# EAGLE design sensor_v3b (EAGLE 6.5.0)
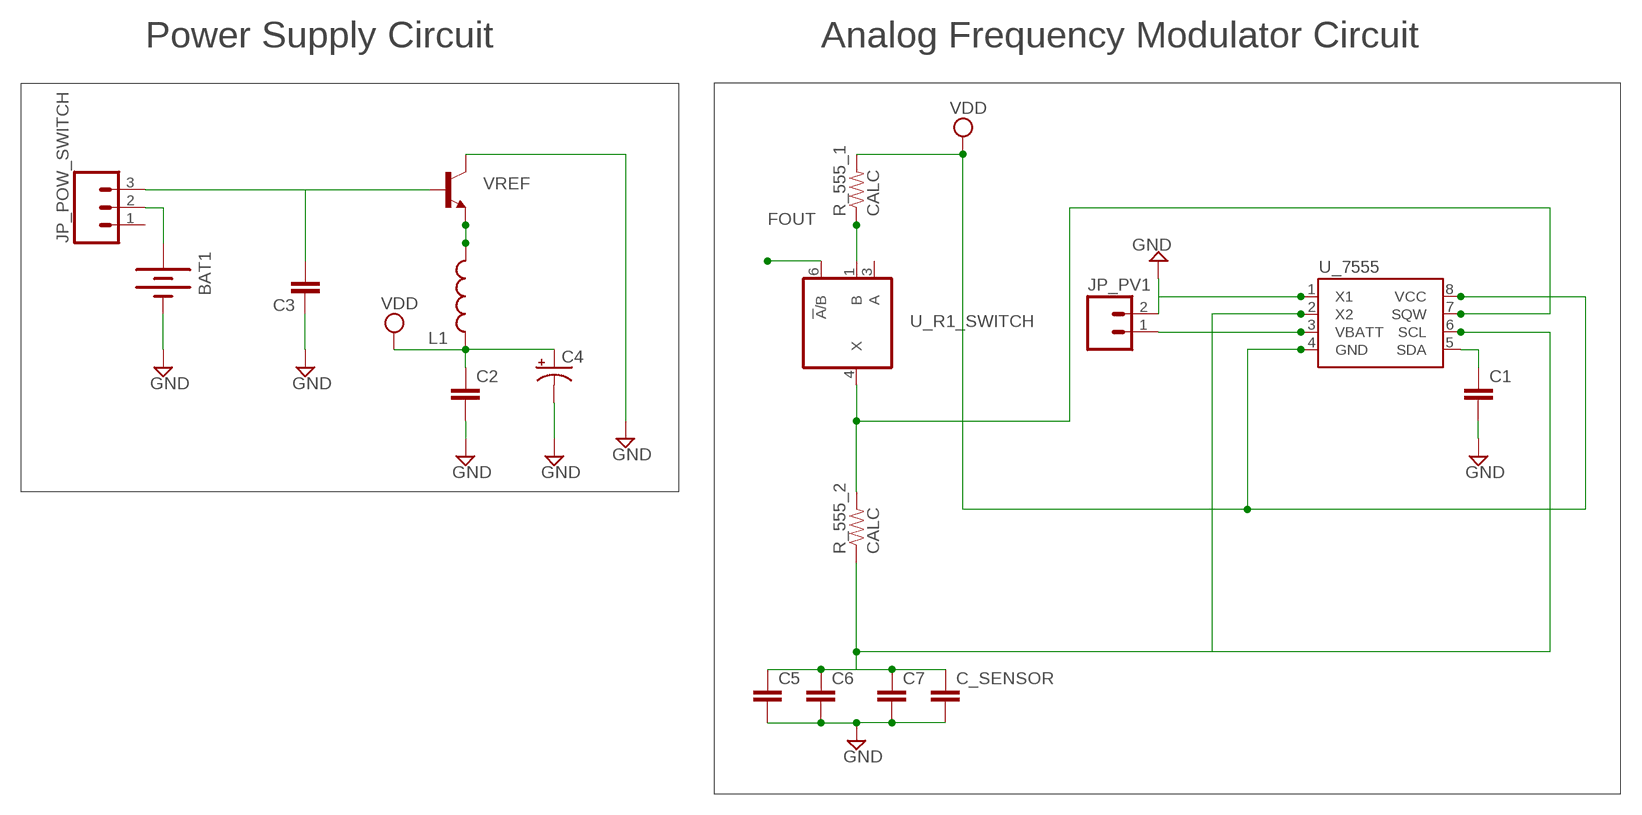
[diagram p0: schematic, sheet 1]

## Parts
BAT1  BATTERY20PTH_LAB  [BATTCOM_20MM_PTH]
C1  CAP0603-CAP  [0603-CAP]
C2  CAP0603-CAP  [0603-CAP]
C3  CAP0603-CAP  [0603-CAP]
C4  CAP_POL1206  [EIA3216]
C5  CAP0805  [0805]
C6  CAP0805  [0805]
C7  CAP0805  [0805]
C_SENSOR  CAP0805  [0805]
JP_POW_SWITCH  M03LOCK  [1X03_LOCK]
JP_PV1  M02LOCK  [1X02_LOCK]
L1  INDUCTOR0603  [0603]
R_555_1  CALC  RESISTOR0805-RES  [0805]
R_555_2  CALC  RESISTOR0805-RES  [0805]
U_7555  DS1307SO8  [SO08]
U_R1_SWITCH  741G3157DCKR  [DCK_R-PDSO-G6]
U_VREF  TRANSISTOR_NPNSOT23-3  [SOT23-3]

## Nets
FOUT: JP_PV1.1 U_7555.3(VBATT) U_R1_SWITCH.6(!A!/B)
GND: BAT1.2(-) C1.2 C2.2 C3.1 C4.C(-) C5.2 C6.2 C7.2 C_SENSOR.2 JP_PV1.2 U_7555.1(X1) U_VREF.3(C)
N$6: BAT1.1(+) JP_POW_SWITCH.2
P2: C5.1 C6.1 C7.1 C_SENSOR.1 R_555_2.1 U_7555.2(X2) U_7555.6(SCL)
P5: C1.1 U_7555.5(SDA)
P7: R_555_2.2 U_7555.7(SQW) U_R1_SWITCH.4(X)
R1: R_555_1.1 U_R1_SWITCH.1(B)
VDD: C2.1 C4.A(+) L1.1 R_555_1.2 U_7555.4(GND) U_7555.8(VCC)
VREFIN: C3.2 JP_POW_SWITCH.3 U_VREF.1(B)
VREFOUT: L1.2 U_VREF.2(E)
Unconnected: JP_POW_SWITCH.1 U_R1_SWITCH.3(A)

## Notes on the sheet
- Power Supply Circuit | Analog Frequency Modulator Circuit
- VREF

## Power pins joined to a net without a drawn wire
GND: U_R1_SWITCH.2(GND)
VCC: U_R1_SWITCH.5(VCC)

## Library data of the parts
BAT1 = semipassiveTag_library:BATTERY: Battery Holders Various common sizes : AA, AAA, 20mm coin cell and 12mm coin cell.
C1-C3 = SparkFun-Capacitors:CAP: Capacitor Standard 0603 ceramic capacitor, and 0.1" leaded capacitor.
C4 = SparkFun-Capacitors:CAP_POL: Capacitor Polarized These are standard SMD and PTH capacitors. Normally 10uF, 47uF, and 100uF in electrolytic and tantalum varieties. Always verify the external diameter of the through hole cap, it varies with capacity, voltage, and manufacturer. The EIA devices should be standard.
C5-C7 C_SENSOR = SparkFun:CAP: Capacitor Standard 0603 ceramic capacitor, and 0.1" leaded capacitor.
JP_POW_SWITCH = SparkFun-Connectors:M03: Header 3 Standard 3-pin 0.1" header. Use with straight break away headers (SKU : PRT-00116), right angle break away headers (PRT-00553), swiss pins (PRT-00743), machine pins (PRT-00117), and female headers (PRT-00115). Molex polarized connector foot print use with SKU : PRT-08232 with associated crimp pins and housings.
JP_PV1 = SparkFun-Connectors:M02: Header 2 Standard 2-pin 0.1" header. Use with straight break away headers (SKU : PRT-00116), right angle break away headers (PRT-00553), swiss pins (PRT-00743), machine pins (PRT-00117), and female headers (PRT-00115). Molex polarized connector foot print use with SKU : PRT-08233 with associated crimp pins and housings.
L1 = SparkFun-Passives:INDUCTOR: Inductors Basic Inductor/Choke - 0603 and 1206. Footprints are not proven and vary greatly between part numbers.
R_555_1 R_555_2 = SparkFun-Resistors:RESISTOR: Resistor Basic schematic elements and footprints for 0603, 1206, and PTH resistors.
U_7555 = SparkFun-FreqCtrl:DS1307: I2C real-time clock with battery backup.
U_R1_SWITCH = 74xx-little-de:74*1G3157: Single-Pole, Double-Throw Analog Switch Source: http://focus.ti.com/lit/ds/symlink/sn74lvc1g3157.pdf
U_VREF = SparkFun:TRANSISTOR_NPN: Transistor NPN BJT configuration in SOT23 package. MMBT2222 is the common NPN we use. Double check BCE configuration again layout.

## Board
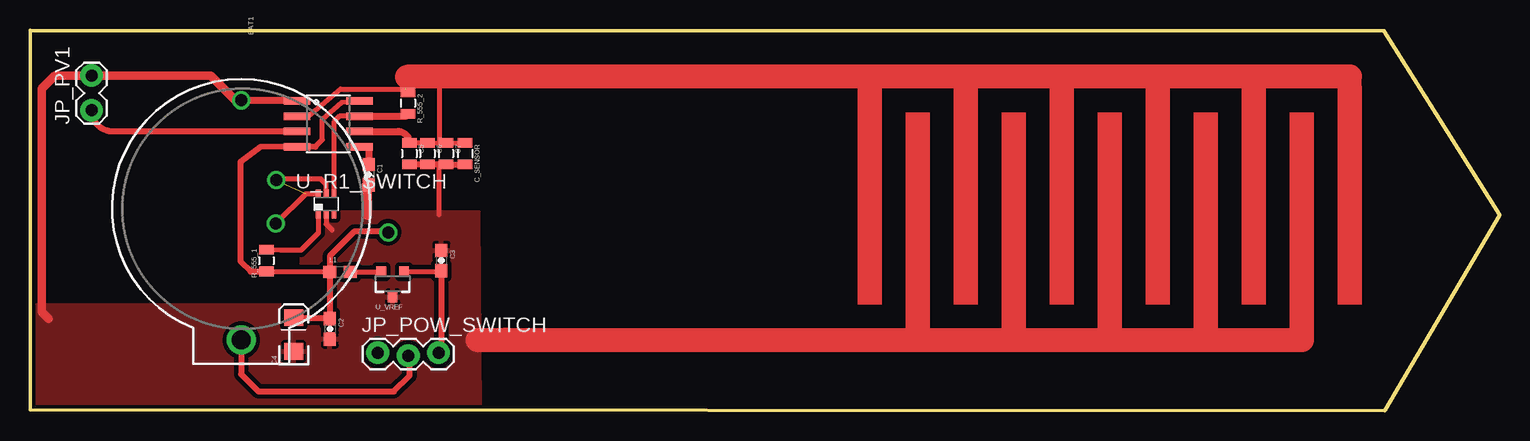
[diagram p1: board, top side]
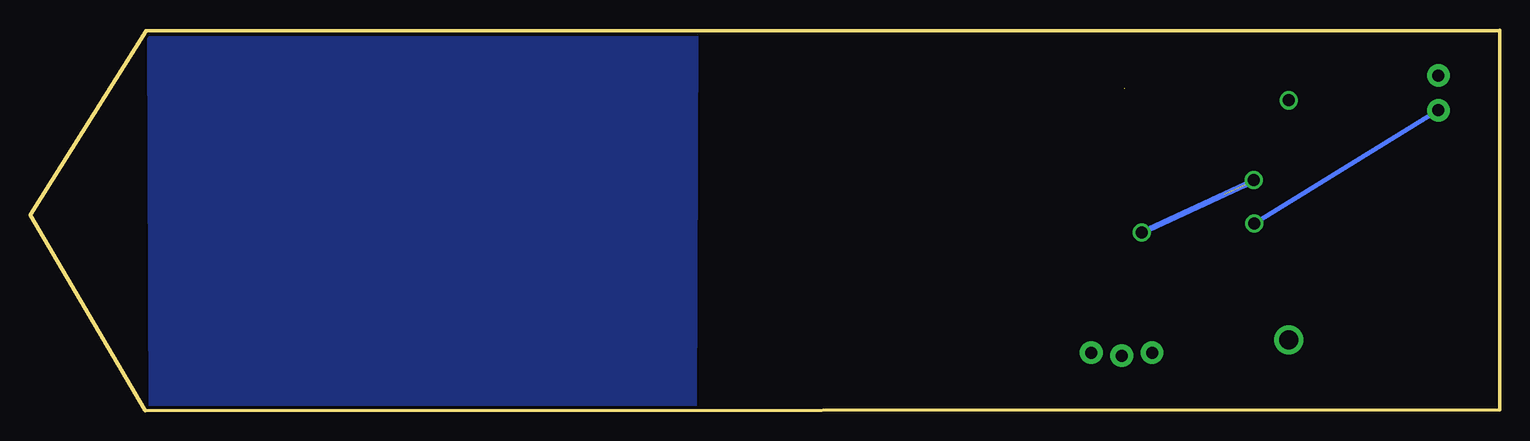
[diagram p2: board, bottom side, seen from below]

Size 122.5 x 31.75 mm. Coordinates in mm from the lower left corner, seen from the top.
Outline: 112.82,31.68 122.5,16.33 112.94,0.06
Outline: 112.89,0 0,0.05 0.02,31.75
Outline: 112.84,31.7 0.02,31.71
Copper layers (1*16): Top 0.035mm / dielectric 1.5mm / Bottom 0.035mm
Design rules "Fusion_eagle_rule_v1.1 *": minimum track width 12mil, minimum drill 12mil, track to track 14mil, track to pad 14mil, pad to pad 14mil, via to via 14mil, smd to smd 0mil, copper to edge 10mil, drill to drill 10mil, minimum pad ring 10mil, minimum via ring 6mil, stop-mask expansion 2mil, vias tented up to drill 100mil, thermal gap 10mil

### Footprints (pad centres in the part's own frame; a part is rotated, then mirrored left to right if it is on the bottom)
BATTCOM_20MM_PTH = drill 1.6: 1 19.99,0 | drill 1: 2 0,0
0603-CAP = smd 1.1 x 1: 1 -0.85,0; 2 0.85,0
EIA3216 = smd 1.4 x 1.6: A 1.4,0; C -1.4,0
0805 = smd 0.8 x 1.2: 1 -0.9,0; 2 0.9,0
1X03_LOCK = drill 1 pad 1.88: 1 0,0.127; 2 2.54,-0.127; 3 5.08,0.127
1X02_LOCK = drill 1 pad 1.88: 1 -0.178,0; 2 2.718,0
0603 = smd 1.1 x 1: 1 -0.85,0; 2 0.85,0
SO08 = smd 0.61 x 2.21: 1 -1.905,-2.616; 2 -0.635,-2.616; 3 0.635,-2.616; 4 1.905,-2.616; 5 1.905,2.616; 6 0.635,2.616; 7 -0.635,2.616; 8 -1.905,2.616
DCK_R-PDSO-G6 = smd 0.4 x 0.7: 1 -0.65,-0.85; 2 0,-0.85; 3 0.65,-0.85; 4 0.65,0.85; 5 0,0.85; 6 -0.65,0.85
SOT23-3 = smd 0.8 x 0.9: 1 -0.95,-1; 2 0.95,-1; 3 0,1.1

### Placement (x,y rotation side)
BAT1  17.6,25.88 270 top
C1  28.21,19.68 270 top
C2  24.99,6.81 270 top
C3  34.27,12.51 270 top
C4  21.97,6.35 90 top
C5  31.61,21.45 270 top
C6  33.11,21.45 270 top
C7  34.67,21.44 270 top
C_SENSOR  36.26,21.45 270 top
JP_POW_SWITCH  28.98,4.71 0 top
JP_PV1  5.14,25.23 90 top
L1  25.84,11.59 0 top
R_555_1  19.69,12.51 270 top
R_555_2  31.5,25.66 270 top
U_7555  24.85,23.92 270 top
U_R1_SWITCH  24.68,17.24 0 top
U_VREF  30.22,10.59 180 top

### Tracks (layer width: path | path; a pad name or v marks a point on that pad's centre or on a via)
FOUT  (via drill 1)  (1 unrouted)
  Top 0.4: U_R1_SWITCH.6 22.96,18.09 v20.49,15.62
  Top 0.5: 8.02,23.28 U_7555.3 6.91,23.28 arc-90 JP_PV1.1
  Top 0.61: 22.22,23.28 arc45 U_7555.3
  Bottom 0.406: v20.49,15.62 JP_PV1.1
  Bottom 0.5: v20.52,19.24 21.21,18.86 v29.85,14.88
GND
  Top 0.4: 25.17,15.06 24.68,15.55 U_R1_SWITCH.2
  Top 0.406: C5.2 34.08,20.55 34.08,16.36
  Top 0.5: C5.2 C6.2 C7.2 C_SENSOR.2
  Top 0.6: BAT1.2 22.18,25.88 arc-90 U_7555.1
  Top 0.7: BAT1.2 17.11,25.88 15.05,27.94 JP_PV1.2 2.07,27.94 0.98,26.85 0.98,8.24 1.57,7.65
  Top 0.813: C1.2 28.08,18.83 28.08,16.36
  Top 2: 105.99,6.86 105.99,5.88 37.28,5.87 39.64,5.94
  pour Top: -0.39,-0.4 37.46,-0.31 37.36,16.53 22.55,16.49 22.62,16.29 22.64,8.76 -0.24,8.73
N2
  pour Bottom: 66.98,31.88 112.57,31.66 112.45,-0.37 67.11,-0.06
N$4
  Top 0.4: 24.66,18.87 24.66,18.92 24.24,19.34 20.54,19.34 20.5,19.3
N$5
  Top 0.4: 24.67,18.13 24.67,18.91
N$6
  Top 0.5: BAT1.1 17.6,3.04 19.03,1.61 30.33,1.61 31.63,2.91 31.63,4.47 JP_POW_SWITCH.2
N$7
  Top 0.5: 29.78,14.93 27.02,14.93 24.99,12.9 24.99,11.61 24.97,11.59
P2  (1 unrouted)
  Top 0.3: 30.83,26.85 31.3,26.85 31.31,26.84 31.31,26.86 31.33,26.88
  Top 0.406: 22.31,24.53 22.18,24.53 U_7555.2 23.2,24.53 25.88,26.84 31.58,26.84 | 31.58,26.84 31.28,26.85 | 57.5,27.38 57.3,27.58 57.3,27.87 57.99,27.87 58,27.88 | 32.58,27.11 34.17,27.87 | 34.16,27.88 34.13,22.36 C7.1 | 31.58,26.84 R_555_2.1 | 31.58,26.84 31.4,27.86 | C5.1 C6.1 C7.1 | C7.1 C_SENSOR.1
  Top 0.6: U_7555.6 30.67,23.28 arc-90 C5.1
  Top 2: 109.98,26.89 109.98,27.88 58,27.88 34.16,27.88 34.17,27.87 31.4,27.86
P5
  Top 0.406: U_7555.5 28.21,22.01
  Top 0.6: 28.21,22.01 C1.1
P7
  Top 0.406: U_7555.7 25.78,24.55 25.33,24.11 U_R1_SWITCH.4
  Top 0.6: U_7555.7 31.3,24.55 arc90 R_555_2.2
R1
  Top 0.4: U_R1_SWITCH.1 24.03,14.84 22.57,13.38 20.91,13.38 R_555_1.1
VDD
  Top 0.406: U_7555.4 23.79,22.01 24.37,22.59 24.37,24.31 25.98,25.71 26.77,25.79 U_7555.8 | L1.1 24.99,11.61 R_555_1.2 19.22,11.61
  Top 0.5: 23.79,22.01 19.19,21.99 17.53,20.74 17.53,12.46 18.38,11.61 R_555_1.2 | L1.1 C2.1 24.91,7.75 C4.A
VREFIN
  Top 0.406: U_VREF.1 34.28,11.59 C3.2
  Top 0.5: JP_POW_SWITCH.3 34.28,5.05 34.28,11.59
VREFOUT
  Top 0.406: L1.2 U_VREF.2
(copper drawn outside any net)
  shapes: Top area x12